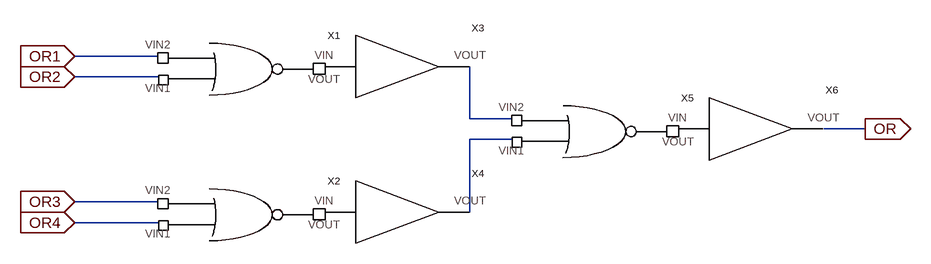
[diagram p0: schematic or4.asc]
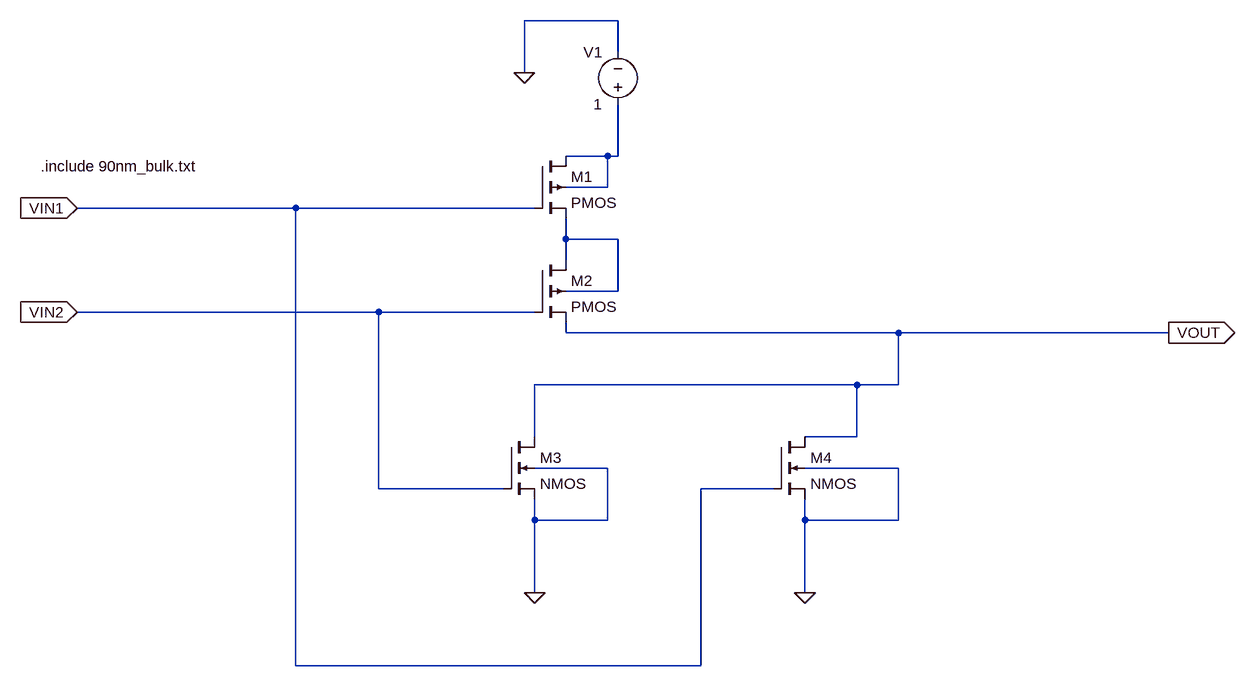
[diagram p1: sub-circuit symbol_valve.asc]
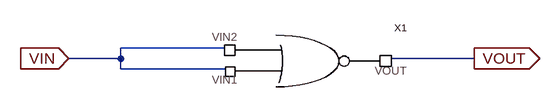
[diagram p2: sub-circuit not.asc]
or4.asc, the LTspice schematic file:
Version 4
SHEET 1 1324 680
WIRE 144 128 16 128
WIRE 144 160 16 160
WIRE 624 224 624 144
WIRE 688 224 624 224
WIRE 1232 240 1168 240
WIRE 688 256 624 256
WIRE 144 352 16 352
WIRE 624 368 624 256
WIRE 144 384 16 384
FLAG 16 128 OR1
IOPIN 16 128 In
FLAG 16 160 OR2
IOPIN 16 160 In
FLAG 16 352 OR3
IOPIN 16 352 In
FLAG 16 384 OR4
IOPIN 16 384 In
FLAG 1232 240 OR
IOPIN 1232 240 Out
SYMBOL symbol_valve 272 208 R0
SYMATTR InstName X1
SYMBOL symbol_valve 272 432 R0
SYMATTR InstName X2
SYMBOL not 480 144 R0
SYMATTR InstName X3
SYMBOL not 480 368 R0
SYMATTR InstName X4
SYMBOL symbol_valve 816 304 R0
SYMATTR InstName X5
SYMBOL not 1024 240 R0
SYMATTR InstName X6

symbol_valve.asc, the sub-circuit schematic file:
Version 4
SHEET 1 1116 900
WIRE 144 -96 0 -96
WIRE 144 -48 144 -96
WIRE 0 -16 0 -96
WIRE 128 112 64 112
WIRE 144 112 144 32
WIRE 144 112 128 112
WIRE 128 160 128 112
WIRE 128 160 64 160
WIRE -352 192 -688 192
WIRE 16 192 -352 192
WIRE 64 240 64 208
WIRE 144 240 64 240
WIRE 64 272 64 240
WIRE 144 320 144 240
WIRE 144 320 64 320
WIRE -224 352 -688 352
WIRE 16 352 -224 352
WIRE 64 384 64 368
WIRE 576 384 64 384
WIRE 992 384 576 384
WIRE 512 464 16 464
WIRE 576 464 576 384
WIRE 576 464 512 464
WIRE 16 544 16 464
WIRE 512 544 512 464
WIRE 512 544 432 544
WIRE 128 592 16 592
WIRE 576 592 432 592
WIRE -224 624 -224 352
WIRE -32 624 -224 624
WIRE 384 624 272 624
WIRE 16 672 16 640
WIRE 128 672 128 592
WIRE 128 672 16 672
WIRE 432 672 432 640
WIRE 576 672 576 592
WIRE 576 672 432 672
WIRE 16 784 16 672
WIRE 432 784 432 672
WIRE -352 896 -352 192
WIRE 272 896 272 624
WIRE 272 896 -352 896
FLAG 16 784 0
FLAG 432 784 0
FLAG 992 384 VOUT
IOPIN 992 384 Out
FLAG -688 192 VIN1
IOPIN -688 192 In
FLAG -688 352 VIN2
IOPIN -688 352 In
FLAG 0 -16 0
SYMBOL pmos4 16 112 R0
SYMATTR InstName M1
SYMATTR Value2 l=90n w=400n
SYMBOL pmos4 16 272 R0
SYMATTR InstName M2
SYMATTR Value2 l=90n w=400n
SYMBOL nmos4 -32 544 R0
SYMATTR InstName M3
SYMATTR Value2 l=90n w=200n
SYMBOL nmos4 384 544 R0
SYMATTR InstName M4
SYMATTR Value2 l=90n w=200n
SYMBOL voltage 144 48 R180
WINDOW 0 24 96 Left 2
WINDOW 3 24 16 Left 2
WINDOW 123 0 0 Left 0
WINDOW 39 0 0 Left 0
SYMATTR InstName V1
SYMATTR Value 1
TEXT -744 128 Left 2 !.include 90nm_bulk.txt

not.asc, the sub-circuit schematic file:
Version 4
SHEET 1 880 680
WIRE 128 160 -32 160
WIRE -32 176 -32 160
WIRE -32 176 -112 176
WIRE 512 176 384 176
WIRE -32 192 -32 176
WIRE 128 192 -32 192
FLAG -112 176 VIN
IOPIN -112 176 In
FLAG 512 176 VOUT
IOPIN 512 176 Out
SYMBOL symbol_valve 256 240 R0
SYMATTR InstName X1

The netlist it stands for:
* or4.asc
XX1 OR2 OR1 P001 symbol_valve
XX2 OR4 OR3 P002 symbol_valve
XX3 P001 N001 not
XX4 P002 N002 not
XX5 N002 N001 P003 symbol_valve
XX6 P003 OR not

* block symbol definitions
.subckt symbol_valve VIN1 VIN2 VOUT
M1 N001 VIN1 N002 N001 PMOS l=90n w=400n
M2 N002 VIN2 VOUT N002 PMOS l=90n w=400n
M3 VOUT VIN2 0 0 NMOS l=90n w=200n
M4 VOUT VIN1 0 0 NMOS l=90n w=200n
V1 N001 0 1
.include 90nm_bulk.txt
.ends symbol_valve

.subckt not VIN VOUT
XX1 VIN VIN VOUT symbol_valve
.ends not

.model NMOS NMOS
.model PMOS PMOS
.lib standard.mos
.backanno
.end